# Altium schematic sheet master.SchDoc
size Letter; DrawnBy: Robson Souza; SheetNumber: 1; SheetTotal: 9
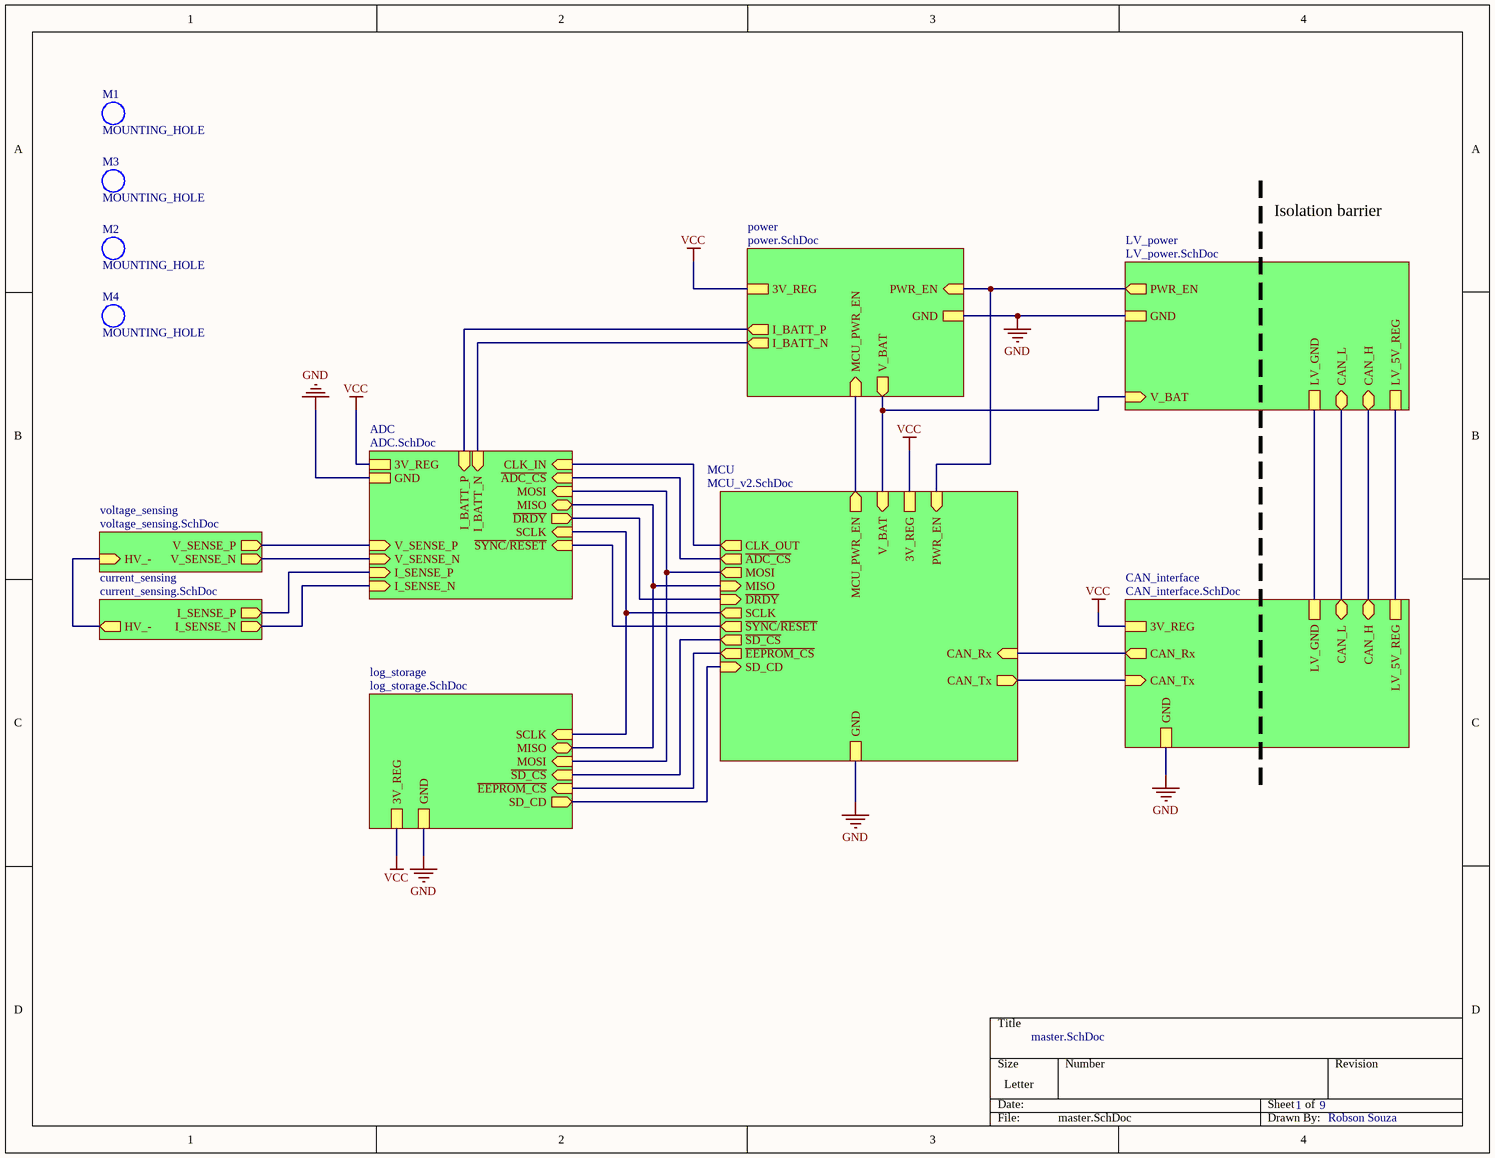
[diagram p0: master.SchDoc]

## Parts
M1  MOUNTING_HOLE  [MOUNTING_HOLE]
M2  MOUNTING_HOLE  [MOUNTING_HOLE]
M3  MOUNTING_HOLE  [MOUNTING_HOLE]
M4  MOUNTING_HOLE  [MOUNTING_HOLE]

## Sub-sheets
ADC = ADC.SchDoc: 3V_REG, GND, CLK_IN (in), ~{ADC_CS} (in), MOSI (in), MISO (bidir), ~{DRDY} (out), SCLK (in), ~{SYNC}/~{RESET} (in), V_SENSE_P (in), V_SENSE_N (in), I_SENSE_P (in), I_SENSE_N (in), I_BATT_P (in), I_BATT_N (in)
CAN_interface = CAN_interface.SchDoc: CAN_Rx (out), CAN_Tx (in), CAN_H (bidir), CAN_L (bidir), LV_GND, GND, 3V_REG, LV_5V_REG
current_sensing = current_sensing.SchDoc: I_SENSE_P (out), I_SENSE_N (out), HV_- (out)
log_storage = log_storage.SchDoc: 3V_REG, GND, MOSI (in), MISO (bidir), SCLK (in), ~{SD_CS} (in), ~{EEPROM_CS} (in), SD_CD (out)
LV_power = LV_power.SchDoc: CAN_H (bidir), CAN_L (bidir), LV_GND, PWR_EN (out), GND, V_BAT (in), LV_5V_REG
MCU = MCU_v2.SchDoc: CAN_Rx (in), CAN_Tx (out), GND, V_BAT (in), 3V_REG, CLK_OUT (out), ~{ADC_CS} (out), MOSI (out), MISO (in), ~{DRDY} (in), SCLK (out), ~{SYNC}/~{RESET} (out), ~{SD_CS} (out), ~{EEPROM_CS} (out), PWR_EN (in), MCU_PWR_EN (out), SD_CD (in)
power = power.SchDoc: PWR_EN (in), GND, 3V_REG, V_BAT (out), MCU_PWR_EN (in), I_BATT_P (out), I_BATT_N (out)
voltage_sensing = voltage_sensing.SchDoc: V_SENSE_P (out), V_SENSE_N (out), HV_- (in)

## Nets
GND: sheet MCU/GND, sheet CAN_interface/GND, sheet LV_power/GND, sheet log_storage/GND, sheet power/GND, sheet ADC/GND
VCC: sheet MCU/3V_REG, sheet CAN_interface/3V_REG, sheet log_storage/3V_REG, sheet power/3V_REG, sheet ADC/3V_REG
(unnamed): sheet MCU/CAN_Rx, sheet CAN_interface/CAN_Rx
(unnamed): sheet MCU/CAN_Tx, sheet CAN_interface/CAN_Tx
(unnamed): sheet MCU/V_BAT, sheet LV_power/V_BAT, sheet power/V_BAT
(unnamed): sheet MCU/CLK_OUT, sheet ADC/CLK_IN
(unnamed): sheet MCU/~{ADC_CS}, sheet ADC/~{ADC_CS}
(unnamed): sheet MCU/MOSI, sheet log_storage/MOSI, sheet ADC/MOSI
(unnamed): sheet MCU/MISO, sheet log_storage/MISO, sheet ADC/MISO
(unnamed): sheet MCU/~{DRDY}, sheet ADC/~{DRDY}
(unnamed): sheet MCU/SCLK, sheet log_storage/SCLK, sheet ADC/SCLK
(unnamed): sheet MCU/~{SYNC}/~{RESET}, sheet ADC/~{SYNC}/~{RESET}
(unnamed): sheet MCU/~{SD_CS}, sheet log_storage/~{SD_CS}
(unnamed): sheet MCU/~{EEPROM_CS}, sheet log_storage/~{EEPROM_CS}
(unnamed): sheet MCU/PWR_EN, sheet LV_power/PWR_EN, sheet power/PWR_EN
(unnamed): sheet MCU/MCU_PWR_EN, sheet power/MCU_PWR_EN
(unnamed): sheet MCU/SD_CD, sheet log_storage/SD_CD
(unnamed): sheet CAN_interface/CAN_H, sheet LV_power/CAN_H
(unnamed): sheet CAN_interface/CAN_L, sheet LV_power/CAN_L
(unnamed): sheet CAN_interface/LV_GND, sheet LV_power/LV_GND
(unnamed): sheet CAN_interface/LV_5V_REG, sheet LV_power/LV_5V_REG
(unnamed): sheet power/I_BATT_P, sheet ADC/I_BATT_P
(unnamed): sheet power/I_BATT_N, sheet ADC/I_BATT_N
(unnamed): sheet voltage_sensing/V_SENSE_P, sheet ADC/V_SENSE_P
(unnamed): sheet voltage_sensing/V_SENSE_N, sheet ADC/V_SENSE_N
(unnamed): sheet voltage_sensing/HV_-, sheet current_sensing/HV_-
(unnamed): sheet current_sensing/I_SENSE_P, sheet ADC/I_SENSE_P
(unnamed): sheet current_sensing/I_SENSE_N, sheet ADC/I_SENSE_N

## Notes on the sheet
- Isolation barrier

## Library data of the parts
M1-M4 = MOUNTING_HOLE: Mounting Hole